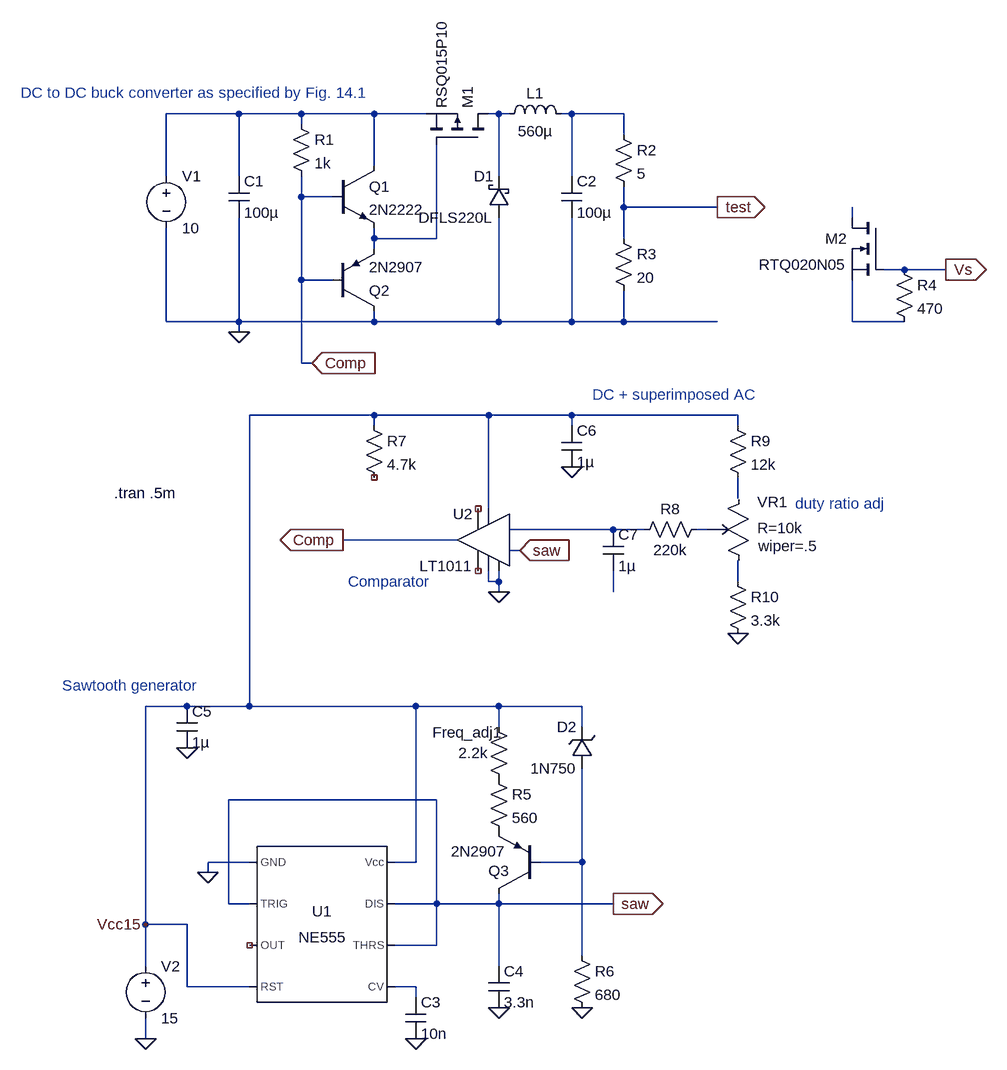
[diagram p0: schematic FullConverter.asc]
FullConverter.asc, the LTspice schematic file:
Version 4
SHEET 1 1724 1572
WIRE 16 128 -96 128
WIRE 112 128 16 128
WIRE 224 128 112 128
WIRE 304 128 224 128
WIRE 416 128 400 128
WIRE 432 128 416 128
WIRE 528 128 512 128
WIRE 608 128 528 128
WIRE 112 144 112 128
WIRE 608 160 608 128
WIRE 224 208 224 128
WIRE -96 224 -96 128
WIRE 16 224 16 128
WIRE 416 224 416 128
WIRE 528 224 528 128
WIRE 112 256 112 224
WIRE 160 256 112 256
WIRE 608 272 608 240
WIRE 752 272 608 272
WIRE 960 288 960 272
WIRE 224 320 224 304
WIRE 320 320 320 176
WIRE 320 320 224 320
WIRE 608 320 608 272
WIRE 224 336 224 320
WIRE 1040 368 1008 368
WIRE 1104 368 1040 368
WIRE 112 384 112 256
WIRE 160 384 112 384
WIRE -96 448 -96 304
WIRE 16 448 16 288
WIRE 16 448 -96 448
WIRE 224 448 224 432
WIRE 224 448 16 448
WIRE 416 448 416 288
WIRE 416 448 224 448
WIRE 528 448 528 288
WIRE 528 448 416 448
WIRE 608 448 608 400
WIRE 608 448 528 448
WIRE 752 448 608 448
WIRE 960 448 960 384
WIRE 1040 448 960 448
WIRE 16 464 16 448
WIRE 112 512 112 384
WIRE 128 512 112 512
WIRE 224 592 32 592
WIRE 400 592 224 592
WIRE 528 592 400 592
WIRE 784 592 528 592
WIRE 224 608 224 592
WIRE 528 608 528 592
WIRE 784 608 784 592
WIRE 784 720 784 688
WIRE 400 736 400 592
WIRE 592 768 432 768
WIRE 640 768 592 768
WIRE 736 768 720 768
WIRE 352 784 176 784
WIRE 448 800 432 800
WIRE 400 848 400 832
WIRE 416 848 416 832
WIRE 416 848 400 848
WIRE 784 848 784 816
WIRE 416 864 416 848
WIRE 592 864 592 832
WIRE -64 1040 -128 1040
WIRE 32 1040 32 592
WIRE 32 1040 -64 1040
WIRE 288 1040 32 1040
WIRE 416 1040 288 1040
WIRE 544 1040 416 1040
WIRE 416 1072 416 1040
WIRE 544 1072 544 1040
WIRE 320 1184 0 1184
WIRE 32 1280 -32 1280
WIRE 288 1280 288 1040
WIRE 288 1280 256 1280
WIRE 544 1280 544 1136
WIRE 544 1280 480 1280
WIRE -32 1296 -32 1280
WIRE 0 1344 0 1184
WIRE 32 1344 0 1344
WIRE 320 1344 320 1184
WIRE 320 1344 256 1344
WIRE 416 1344 416 1328
WIRE 416 1344 320 1344
WIRE 592 1344 416 1344
WIRE -128 1376 -128 1040
WIRE -64 1376 -128 1376
WIRE 320 1408 320 1344
WIRE 320 1408 256 1408
WIRE 544 1424 544 1280
WIRE -128 1440 -128 1376
WIRE 416 1440 416 1344
WIRE -64 1472 -64 1376
WIRE 32 1472 -64 1472
WIRE 288 1472 256 1472
WIRE 288 1488 288 1472
WIRE -128 1552 -128 1520
FLAG 16 464 0
FLAG 1104 368 Vs
IOPIN 1104 368 Out
FLAG -128 1552 0
FLAG -32 1296 0
FLAG 288 1552 0
FLAG 416 1504 0
FLAG -64 1104 0
FLAG 544 1504 0
FLAG 592 1344 saw
IOPIN 592 1344 Out
FLAG 416 864 0
FLAG 448 800 saw
IOPIN 448 800 In
FLAG 528 672 0
FLAG 784 928 0
FLAG 128 512 Comp
IOPIN 128 512 In
FLAG 752 272 test
IOPIN 752 272 Out
FLAG 176 784 Comp
IOPIN 176 784 Out
FLAG -128 1376 Vcc15
SYMBOL voltage -96 208 R0
WINDOW 123 0 0 Left 0
WINDOW 39 0 0 Left 0
SYMATTR InstName V1
SYMATTR Value 10
SYMBOL cap 0 224 R0
SYMATTR InstName C1
SYMATTR Value 100µ
SYMBOL res 96 128 R0
SYMATTR InstName R1
SYMATTR Value 1k
SYMBOL npn 160 208 R0
SYMATTR InstName Q1
SYMATTR Value 2N2222
SYMBOL pnp 160 432 M180
SYMATTR InstName Q2
SYMATTR Value 2N2907
SYMBOL pmos 400 176 M270
SYMATTR InstName M1
SYMATTR Value RSQ015P10
SYMBOL ind 416 144 R270
WINDOW 0 32 56 VTop 2
WINDOW 3 5 56 VBottom 2
SYMATTR InstName L1
SYMATTR Value 560µ
SYMATTR SpiceLine Ipk=0.55 Rser=0.23 Rpar=1.19795e+06 Cpar=0
SYMBOL cap 512 224 R0
SYMATTR InstName C2
SYMATTR Value 100µ
SYMBOL schottky 432 288 R180
WINDOW 0 24 64 Left 2
WINDOW 3 24 0 Left 2
SYMATTR InstName D1
SYMATTR Value DFLS220L
SYMATTR Description Diode
SYMATTR Type diode
SYMBOL res 592 144 R0
SYMATTR InstName R2
SYMATTR Value 5
SYMBOL res 592 304 R0
SYMATTR InstName R3
SYMATTR Value 20
SYMBOL nmos 1008 288 M0
SYMATTR InstName M2
SYMATTR Value RTQ020N05
SYMBOL res 1024 352 R0
SYMATTR InstName R4
SYMATTR Value 470
SYMBOL Misc\\NE555 144 1376 R0
SYMATTR InstName U1
SYMBOL voltage -128 1424 R0
WINDOW 123 0 0 Left 0
WINDOW 39 0 0 Left 0
SYMATTR InstName V2
SYMATTR Value 15
SYMBOL res 400 1136 R0
SYMATTR InstName R5
SYMATTR Value 560
SYMBOL pnp 480 1328 R180
WINDOW 0 48 35 Left 2
WINDOW 3 53 65 Left 2
SYMATTR InstName Q3
SYMATTR Value 2N2907
SYMBOL zener 560 1136 R180
WINDOW 0 24 64 Left 2
WINDOW 3 24 0 Left 2
SYMATTR InstName D2
SYMATTR Value 1N750
SYMBOL cap 272 1488 R0
SYMATTR InstName C3
SYMATTR Value 10n
SYMBOL res 528 1408 R0
SYMATTR InstName R6
SYMATTR Value 680
SYMBOL cap 400 1440 R0
SYMATTR InstName C4
SYMATTR Value 3.3n
SYMBOL cap -80 1040 R0
SYMATTR InstName C5
SYMATTR Value 1µ
SYMBOL res 400 1056 R0
WINDOW 0 -86 24 Left 2
WINDOW 3 -46 56 Left 2
SYMATTR InstName Freq_adj1
SYMATTR Value 2.2k
SYMBOL Comparators\\LT1011 400 784 M0
SYMATTR InstName U2
SYMBOL res 208 592 R0
SYMATTR InstName R7
SYMATTR Value 4.7k
SYMBOL cap 512 608 R0
SYMATTR InstName C6
SYMATTR Value 1µ
SYMBOL cap 576 768 R0
SYMATTR InstName C7
SYMATTR Value 1µ
SYMBOL res 736 752 R90
WINDOW 0 0 56 VBottom 2
WINDOW 3 32 56 VTop 2
SYMATTR InstName R8
SYMATTR Value 220k
SYMBOL potentiometer 784 816 R0
SYMATTR InstName VR1
SYMATTR SpiceLine R=10k
SYMATTR SpiceLine2 wiper=.5
SYMBOL res 768 592 R0
SYMATTR InstName R9
SYMATTR Value 12k
SYMBOL res 768 832 R0
SYMATTR InstName R10
SYMATTR Value 3.3k
TEXT -320 96 Left 2 ;DC to DC buck converter as specified by Fig. 14.1
TEXT -256 1008 Left 2 ;Sawtooth generator
TEXT -176 712 Left 2 !.tran .5m
TEXT 184 848 Left 2 ;Comparator
TEXT 560 560 Left 2 ;DC + superimposed AC
TEXT 872 728 Left 2 ;duty ratio adj

The netlist it stands for:
* FullConverter.asc
V1 N001 0 10
C1 N001 0 100µ
R1 N001 Comp 1k
Q1 N001 Comp N005 0 2N2222
Q2 0 Comp N005 0 2N2907
M1 N002 N005 N001 N001 RSQ015P10
L1 N002 N003 560µ Ipk=0.55 Rser=0.23 Rpar=1.19795e+06 Cpar=0
C2 N003 0 100µ
D1 0 N002 DFLS220L
R2 N003 test 5
R3 test 0 20
M2 N004 Vs N006 N006 RTQ020N05
R4 Vs N006 470
XU1 0 saw NC_01 Vcc15 N013 saw saw Vcc15 NE555  ; pins GND TRIG OUT RST CV THRS DIS Vcc
V2 Vcc15 0 15
R5 P001 P002 560
Q3 saw N012 P002 0 2N2907
D2 N012 Vcc15 1N750
C3 N013 0 10n
R6 N012 0 680
C4 saw 0 3.3n
C5 Vcc15 0 1µ
R§Freq_adj1 Vcc15 P001 2.2k
XU2 0 saw N008 0 NC_02 NC_03 Comp Vcc15 LT1011
R7 Vcc15 NC_04 4.7k
C6 Vcc15 0 1µ
C7 N008 N011 1µ
R8 N009 N008 220k
XVR1 N007 N010 N009 potentiometer R=10k wiper=.5  ; pins 1 2 3
R9 Vcc15 N007 12k
R10 N010 0 3.3k
.model D D
.lib standard.dio
.model NPN NPN
.model PNP PNP
.lib standard.bjt
.model NMOS NMOS
.model PMOS PMOS
.lib standard.mos
* DC to DC buck converter as specified by Fig. 14.1
* Sawtooth generator
.tran .5m
* Comparator
* DC + superimposed AC
* duty ratio adj
.lib NE555.sub
.lib LTC1.lib
.lib potentiometer.lib
.backanno
.end